# EAGLE schematic VCO-555-Thomas-Henry (EAGLE 7.6.0)
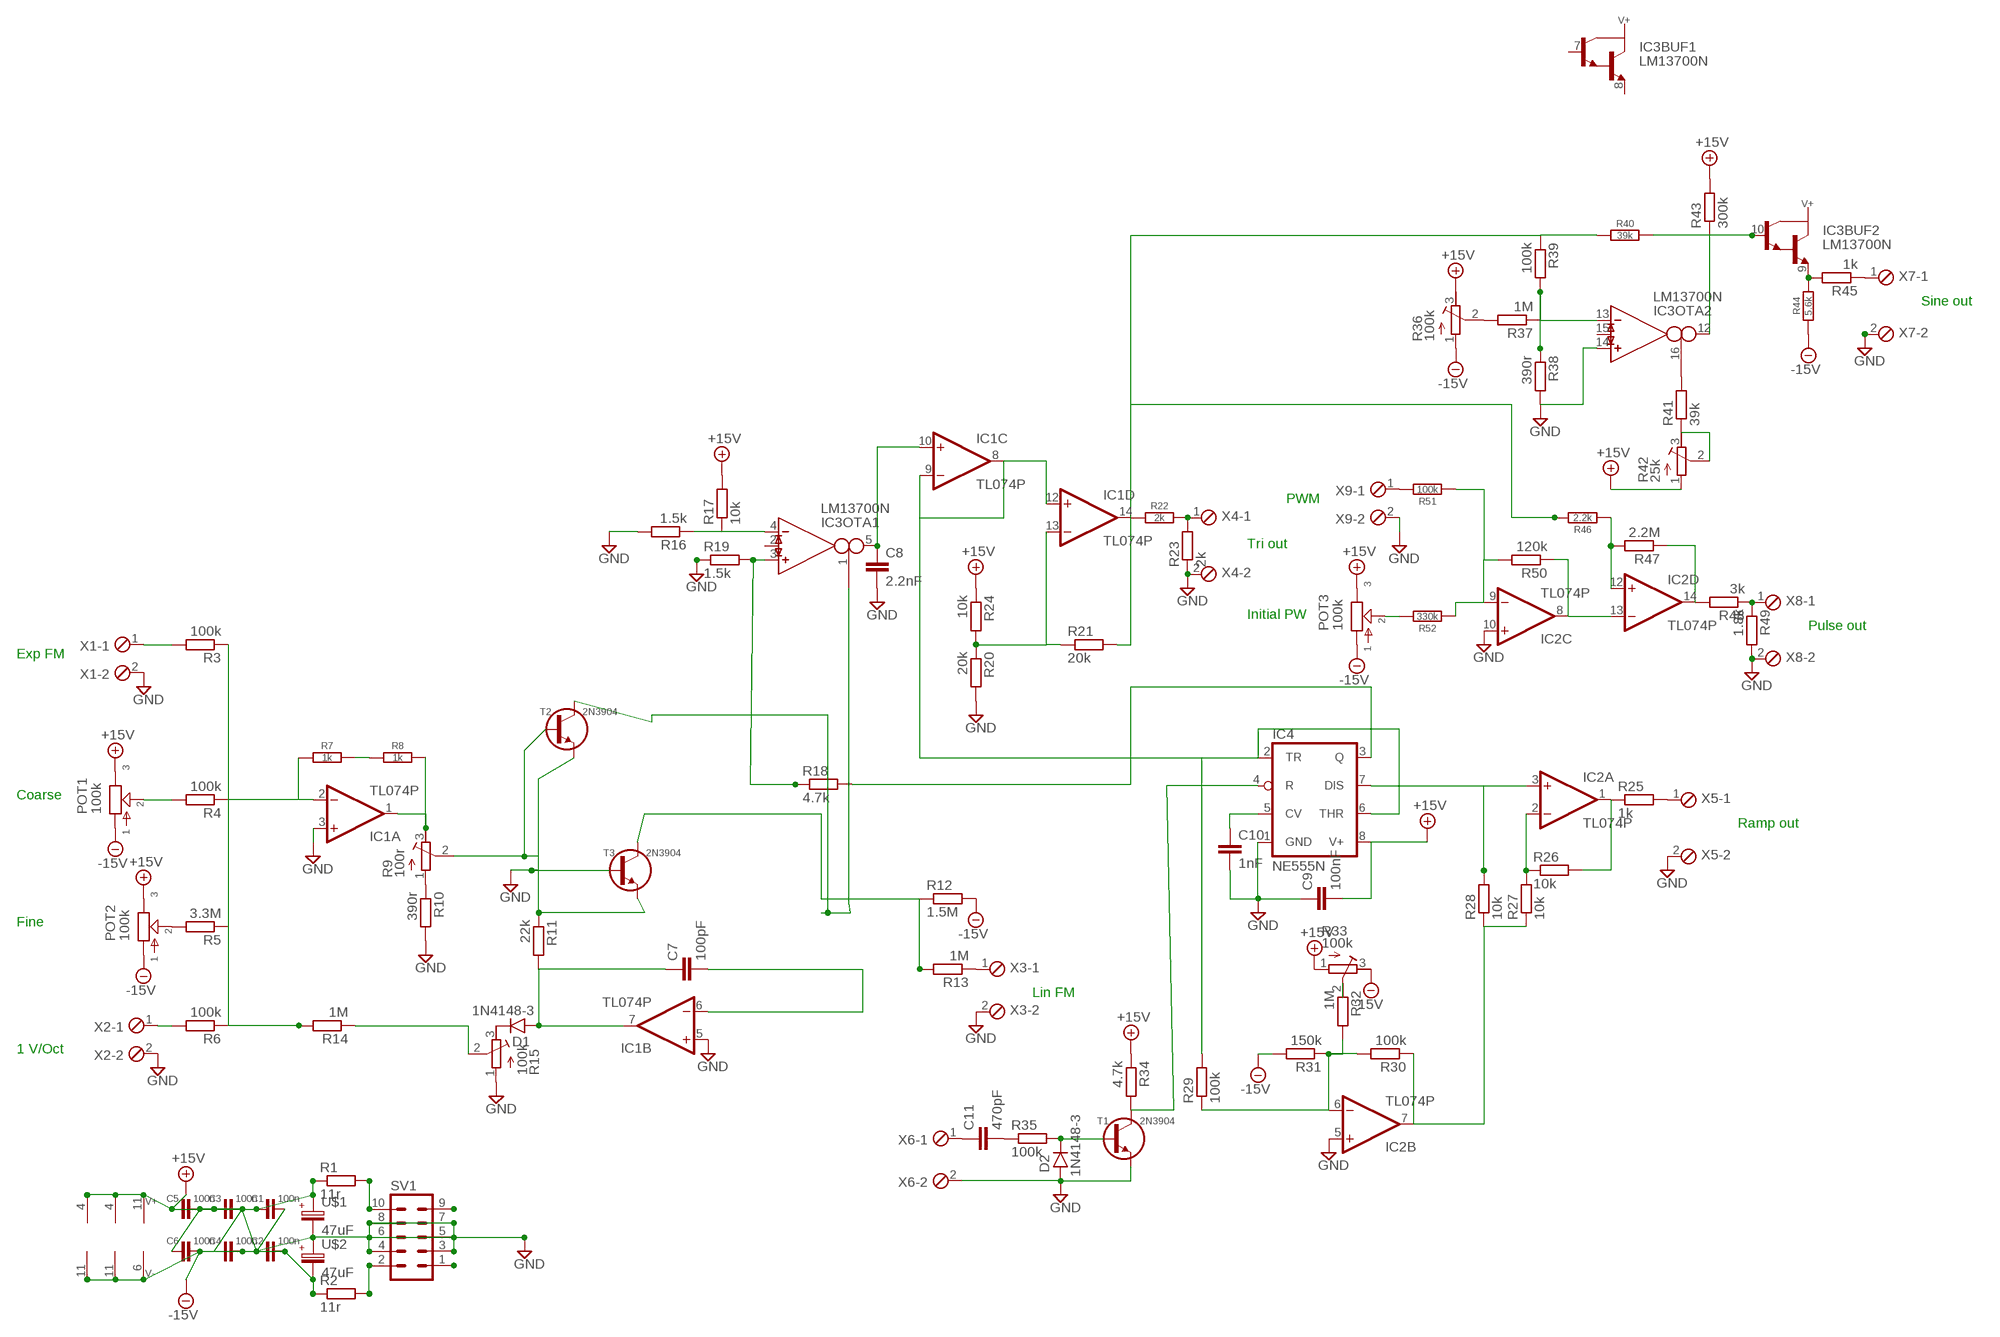
[diagram p0: schematic, sheet 1]

## Parts
C1  100n  C-H050-020X044  [C050-020X044]
C2  100n  C-H050-020X044  [C050-020X044]
C3  100n  C-H050-020X044  [C050-020X044]
C4  100n  C-H050-020X044  [C050-020X044]
C5  100n  C-H050-020X044  [C050-020X044]
C6  100n  C-H050-020X044  [C050-020X044]
C7  100pF  C-EU025-040X050  [C025-040X050]
C8  2.2nF  072X0252  [072X025]
C9  100nF  072X0252  [072X025]
C10  1nF  072X0252  [072X025]
C11  470pF  072X0252  [072X025]
D1  1N4148-3  [DO35-3]
D2  1N4148-3  [DO35-3]
IC1  TL074P  [DIL14]
IC2  TL074P  [DIL14]
IC3  LM13700N  [DIL16]
IC4  NE555N  [DIL08]
POT1  100k  POT-EU16MM  [16MM]
POT2  100k  POT-EU16MM  [16MM]
POT3  100k  POT-EU16MM  [16MM]
R1  11r  R-EU_0207/10  [0207/10]
R2  11r  R-EU_0207/10  [0207/10]
R3  100k  R-EU_0207/10  [0207/10]
R4  100k  R-EU_0207/10  [0207/10]
R5  3.3M  R-EU_0207/10  [0207/10]
R6  100k  R-EU_0207/10  [0207/10]
R7  1k  R-H0204/10  [0204/10]
R8  1k  R-H0204/10  [0204/10]
R9  100r  R-TRIMM3296W  [RTRIM3296W]
R10  390r  R-EU_0207/10  [0207/10]
R11  22k  R-EU_0207/10  [0207/10]
R12  1.5M  R-EU_0207/10  [0207/10]
R13  1M  R-EU_0207/10  [0207/10]
R14  1M  R-EU_0207/10  [0207/10]
R15  100k  R-TRIMM3296W  [RTRIM3296W]
R16  1.5k  R-EU_0207/10  [0207/10]
R17  10k  R-EU_0207/10  [0207/10]
R18  4.7k  R-EU_0207/10  [0207/10]
R19  1.5k  R-EU_0207/10  [0207/10]
R20  20k  R-EU_0207/10  [0207/10]
R21  20k  R-EU_0207/10  [0207/10]
R22  2k  R-H0204/10  [0204/10]
R23  2k  R-EU_0207/10  [0207/10]
R24  10k  R-EU_0207/10  [0207/10]
R25  1k  R-EU_0207/10  [0207/10]
R26  10k  R-EU_0207/10  [0207/10]
R27  10k  R-EU_0207/10  [0207/10]
R28  10k  R-EU_0207/10  [0207/10]
R29  100k  R-EU_0207/10  [0207/10]
R30  100k  R-EU_0207/10  [0207/10]
R31  150k  R-EU_0207/10  [0207/10]
R32  1M  R-EU_0207/10  [0207/10]
R33  100k  R-TRIMM3296W  [RTRIM3296W]
R34  4.7k  R-EU_0207/10  [0207/10]
R35  100k  R-EU_0207/10  [0207/10]
R36  100k  R-TRIMM3296W  [RTRIM3296W]
R37  1M  R-EU_0207/10  [0207/10]
R38  390r  R-EU_0207/10  [0207/10]
R39  100k  R-EU_0207/10  [0207/10]
R40  39k  R-H0204/10  [0204/10]
R41  39k  R-EU_0207/10  [0207/10]
R42  25k  R-TRIMM3296W  [RTRIM3296W]
R43  300k  R-EU_0207/10  [0207/10]
R44  5.6k  R-H0204/10  [0204/10]
R45  1k  R-EU_0207/10  [0207/10]
R46  2.2k  R-H0204/10  [0204/10]
R47  2.2M  R-EU_0207/10  [0207/10]
R48  3k  R-EU_0207/10  [0207/10]
R49  1.8k  R-EU_0207/10  [0207/10]
R50  120k  R-EU_0207/10  [0207/10]
R51  100k  R-H0204/10  [0204/10]
R52  330k  R-H0204/10  [0204/10]
SV1  ML10  [ML10]
T1  2N3904  [TO92]
T2  2N3904  [TO92]
T3  2N3904  [TO92]
U$1  47uF  063-EU  [063_025]
U$2  47uF  063-EU  [063_025]
X1  MPT2  [2POL254]
X2  MPT2  [2POL254]
X3  MPT2  [2POL254]
X4  MPT2  [2POL254]
X5  MPT2  [2POL254]
X6  MPT2  [2POL254]
X7  MPT2  [2POL254]
X8  MPT2  [2POL254]
X9  MPT2  [2POL254]

## Nets
+15V: C1.1 C3.1 C5.1 C9.2 IC1.4(P:V+) IC2.4(P:V+) IC3.11(SUPPLY:V+) IC4.8(V+) POT1.3 POT2.3 POT3.3 R1.1 R17.2 R24.1 R33.1(E) R34.1 R36.3(A) R42.1(E) R43.2 U$1.+
-15V: C2.2 C4.2 C6.2 IC1.11(P:V-) IC2.11(P:V-) IC3.6(SUPPLY:V-) POT1.1 POT2.1 POT3.1 R2.1 R12.2 R31.2 R33.3(A) R36.1(E) R44.1 U$2.-
GND: C1.2 C2.1 C3.2 C4.1 C5.2 C6.1 C8.2 C9.1 C10.2 D2.A IC1.3(A:+IN) IC1.5(B:+IN) IC2.5(B:+IN) IC2.10(C:+IN) IC3.14(OTA2:IN_P) IC4.1(GND) R10.2 R15.1(E) R16.2 R19.1 R20.2 R23.1 R38.2 R49.2 SV1.3 SV1.4 SV1.5 SV1.6 SV1.7 SV1.8 T1.1(E) T3.2(B) U$1.- U$2.+ X1.2 X2.2 X3.2 X4.2 X5.2 X6.2 X7.2 X8.2 X9.2
N$1: D1.C R15.3(A)
N$2: R14.1 R15.2(S)
N$4: IC3.1(OTA1:I_BIAS) T2.3(C)
N$5: R2.2 SV1.2
N$6: R1.2 SV1.10
N$7: IC3.3(OTA1:IN_P) R18.1 R19.2
N$8: IC3.4(OTA1:IN_N) R16.1 R17.1
N$9: C8.1 IC1.10(C:+IN) IC3.5(OTA1:OUT)
N$10: SV1.1
N$11: SV1.9
N$12: R3.2 X1.1
N$13: POT1.2 R4.2
N$14: POT2.2 R5.2
N$15: R6.2 X2.1
N$16: IC1.2(A:-IN) R3.1 R4.1 R5.1 R6.1 R7.1 R14.2
N$17: R7.2 R8.1
N$18: IC1.1(A:OUT) R8.2 R9.3(A)
N$19: R9.1(E) R10.1
N$20: R9.2(S) T2.2(B)
N$21: R11.1 T2.1(E) T3.1(E)
N$22: C7.2 IC1.6(B:-IN)
N$23: R13.1 X3.1
N$24: C7.1 D1.A IC1.7(B:OUT) R11.2
N$25: IC1.8(C:OUT) IC1.9(C:-IN) IC1.12(D:+IN) IC4.2(TR) IC4.6(THR) R29.2
N$26: IC1.13(D:-IN) R20.1 R21.1 R24.2
N$27: IC1.14(D:OUT) R21.2 R22.1 R39.1 R40.1 R46.2
N$28: R22.2 R23.2 X4.1
N$29: IC4.3(Q) R18.2
N$30: IC2.3(A:+IN) IC4.7(DIS) R28.2
N$31: IC2.1(A:OUT) R25.1 R26.2
N$32: IC2.2(A:-IN) R26.1 R27.2
N$33: R25.2 X5.1
N$34: IC2.6(B:-IN) R29.1 R30.2 R31.1 R32.2
N$35: R36.2(S) R37.2
N$36: IC2.7(B:OUT) R27.1 R28.1 R30.1
N$37: R32.1 R33.2(S)
N$38: C10.1 IC4.5(CV)
N$39: IC4.4(R) R34.2 T1.3(C)
N$40: D2.C R35.2 T1.2(B)
N$41: C11.2 R35.1
N$42: C11.1 X6.1
N$43: IC3.16(OTA2:I_BIAS) R41.2
N$44: R41.1 R42.2(S) R42.3(A)
N$45: IC2.12(D:+IN) R46.1 R47.2
N$46: IC3.13(OTA2:IN_N) R37.1 R38.1 R39.2
N$47: IC2.14(D:OUT) R47.1 R48.2
N$48: R48.1 R49.1 X8.1
N$49: IC3.10(BUF2:B) IC3.12(OTA2:OUT) R40.2 R43.1
N$50: IC3.9(BUF2:E) R44.2 R45.2
N$51: R45.1 X7.1
N$52: IC2.8(C:OUT) IC2.13(D:-IN) R50.1
N$53: IC2.9(C:-IN) R50.2 R51.1 R52.1
N$54: R51.2 X9.1
N$55: POT3.2 R52.2
N$57: R12.1 R13.2 T3.3(C)
Unconnected: IC3.2(OTA1:I_DIODE) IC3.7(BUF1:B) IC3.8(BUF1:E) IC3.15(OTA2:I_DIODE)

## Notes on the sheet
- Sine out
- PWM
- Tri out
- Initial PW
- Pulse out
- Exp FM
- Coarse
- Ramp out
- Fine
- Lin FM
- 1 V/Oct

## Library data of the parts
C1-C6 = c:C-H
C7 = resistor:C-EU: CAPACITOR, European symbol
C8-C11 = gm-caps-film-box:072X025: 1000pF - 0.47uF WIMA MKP2 63, 100V: 1000pF - 0.015uF; MKS2 50V: 0.33 - 0.47uF; 63V: 1000pF - 0.22uF;
D1 D2 = gm-diodes:1N4148: Fast Switching Diode DO-35 glass case a.k.a. 1N914
IC1 IC2 = linear:TL074: OP AMP
IC3 = ota:LM13700: Dual OTA with buffers
IC4 = linear:*555: TIMER
POT1-POT3 = gm-pots:POT-EU
R1-R6 R10-R14 R16-R21 R23-R32 R34 R35 R37-R39 R41 R43 R45 R47-R50 = resistor:R-EU_: RESISTOR, European symbol
R7 R8 R22 R40 R44 R46 R51 R52 = r:R-H
R9 R15 R33 R36 R42 = resistor:R-TRIMM: Trimm resistor
SV1 = con-ml:ML10: HARTING; OC_FARNELL: unknown; OC_NEWARK: unknown
T1-T3 = t:2N3904
U$1 U$2 = gm-caps-electro-pol:063-EU
X1-X9 = con-phoenix-254:MPT2: PHOENIX CONNECTOR; OC_FARNELL: unknown; OC_NEWARK: unknown